# Altium schematic sheet sheet6.SchDoc
size A3
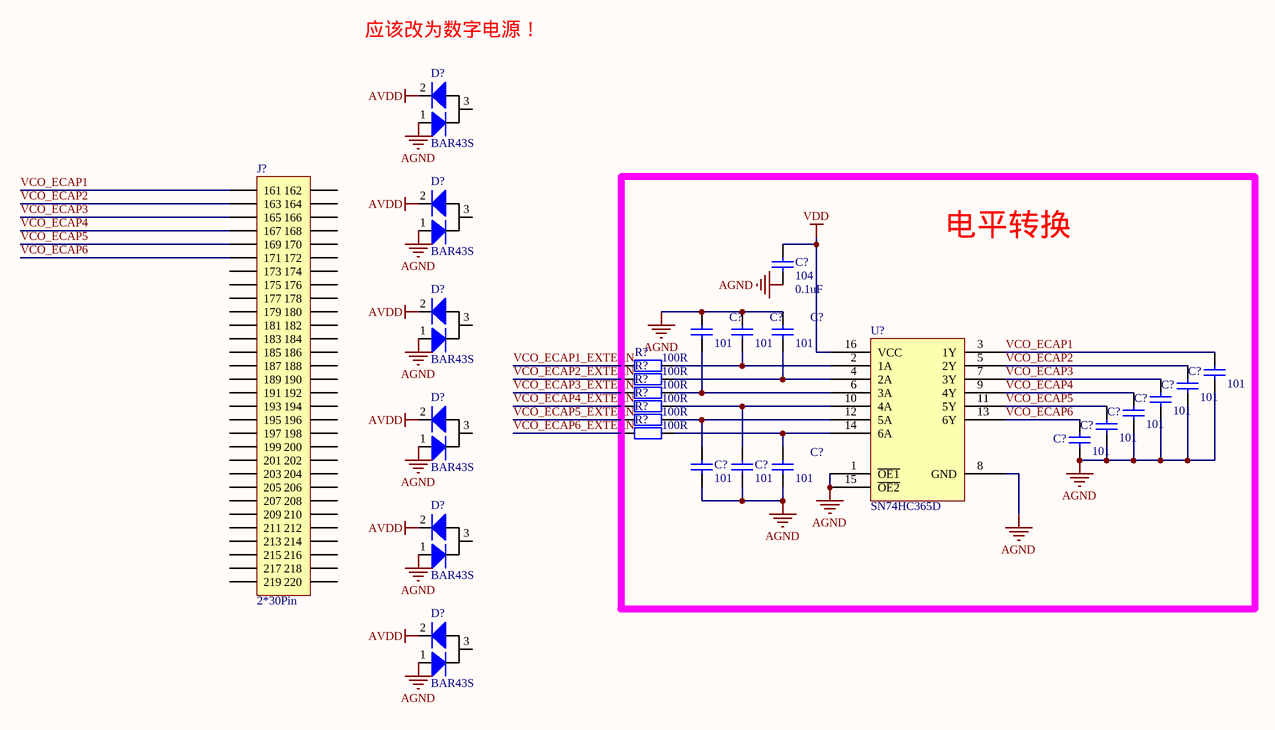
[diagram p0: sheet6.SchDoc]

## Parts
(Parts that share a designator on the sheet are numbered #1, #2 ... from top to bottom, then left to right.)
C?#1  104  value 0.1uF  [0805]
C?#2  101  [0805]
C?#3  101  [0805]
C?#4  101  [0805]
C?#5  101  [0805]
C?#6  101  [0805]
C?#7  101  [0805]
C?#8  101  [0805]
C?#9  101  [0805]
C?#10  101  [0805]
C?#11  101  [0805]
C?#12  101  [0805]
C?#13  101  [0805]
D?#1  BAR43S  [SOT-23]
D?#2  BAR43S  [SOT-23]
D?#3  BAR43S  [SOT-23]
D?#4  BAR43S  [SOT-23]
D?#5  BAR43S  [SOT-23]
D?#6  BAR43S  [SOT-23]
J?  2*30Pin  [DIP220-C]
R?#1  100R  [0805]
R?#2  100R  [0805]
R?#3  100R  [0805]
R?#4  100R  [0805]
R?#5  100R  [0805]
R?#6  100R  [0805]
U?  SN74HC365D  [D016_N]

## Blocks framed on the sheet
电平转换: C?#1-C?#13 R?#1-R?#6 U?

## Nets
AGND: C?#1.2 C?#2.1 C?#3.1 C?#4.1 C?#5.2 C?#6.2 C?#7.2 C?#8.2 C?#9.2 C?#10.2 C?#11.2 C?#12.2 C?#13.2 D?#1.1 D?#2.1 D?#3.1 D?#4.1 D?#5.1 D?#6.1 U?.1(~{OE1}) U?.8(GND) U?.15(~{OE2})
AVDD: D?#1.2 D?#2.2 D?#3.2 D?#4.2 D?#5.2 D?#6.2
VDD: C?#1.1 U?.16(VCC)
VCO_ECAP1: C?#5.1 J?.161 U?.3(1Y)
VCO_ECAP1_EXTERN: R?#1.1
VCO_ECAP2: C?#6.1 J?.163 U?.5(2Y)
VCO_ECAP2_EXTERN: R?#2.1
VCO_ECAP3: C?#7.1 J?.165 U?.7(3Y)
VCO_ECAP3_EXTERN: R?#3.1
VCO_ECAP4: C?#8.1 J?.167 U?.9(4Y)
VCO_ECAP4_EXTERN: R?#4.1
VCO_ECAP5: C?#9.1 J?.169 U?.11(5Y)
VCO_ECAP5_EXTERN: R?#5.1
VCO_ECAP6: C?#10.1 J?.171 U?.13(6Y)
VCO_ECAP6_EXTERN: R?#6.1
NetC?#2_2: C?#2.2 R?#3.2 U?.6(3A)
NetC?#3_2: C?#3.2 R?#1.2 U?.2(1A)
NetC?#4_2: C?#4.2 R?#2.2 U?.4(2A)
NetC?#11_1: C?#11.1 R?#5.2 U?.12(5A)
NetC?#12_1: C?#12.1 R?#4.2 U?.10(4A)
NetC?#13_1: C?#13.1 R?#6.2 U?.14(6A)

Not connected (* = marked no-connect by the designer): D?#1 3; D?#2 3; D?#3 3; D?#4 3; D?#5 3; D?#6 3; J? 162 164 166 168 170 172 173 174 175 176 177 178 179 180 181 182 183 184 185 186 187 188 189 190 191 192 193 194 195 196 197 198 199 200 201 202 203 204 205 206 207 208 209 210 211 212 213 214 215 216 217 218 219 220

## Notes on the sheet
- 应该改为数字电源！

## Library data of the parts
C?#1-C?#13 = Cap: Capacitor; Published: 8-Jun-2000; LatestRevisionDate: 17-Jul-2002; LatestRevisionNote: Re-released for DXP Platform.; PackageReference: RAD-0.3; Publisher: Altium Limited
D?#1-D?#6 = MMBD1203二三极管
R?#1-R?#6 = Res2: Resistor; Value: 3.3K; Published: 8-Jun-2000; LatestRevisionDate: 17-Jul-2002; LatestRevisionNote: Re-released for DXP Platform.; PackageReference: AXIAL-0.4; Publisher: Altium Limited; PackageDescription: Axial Device, Thru-Hole; 2 Leads; 0.4 in Pin Spacing